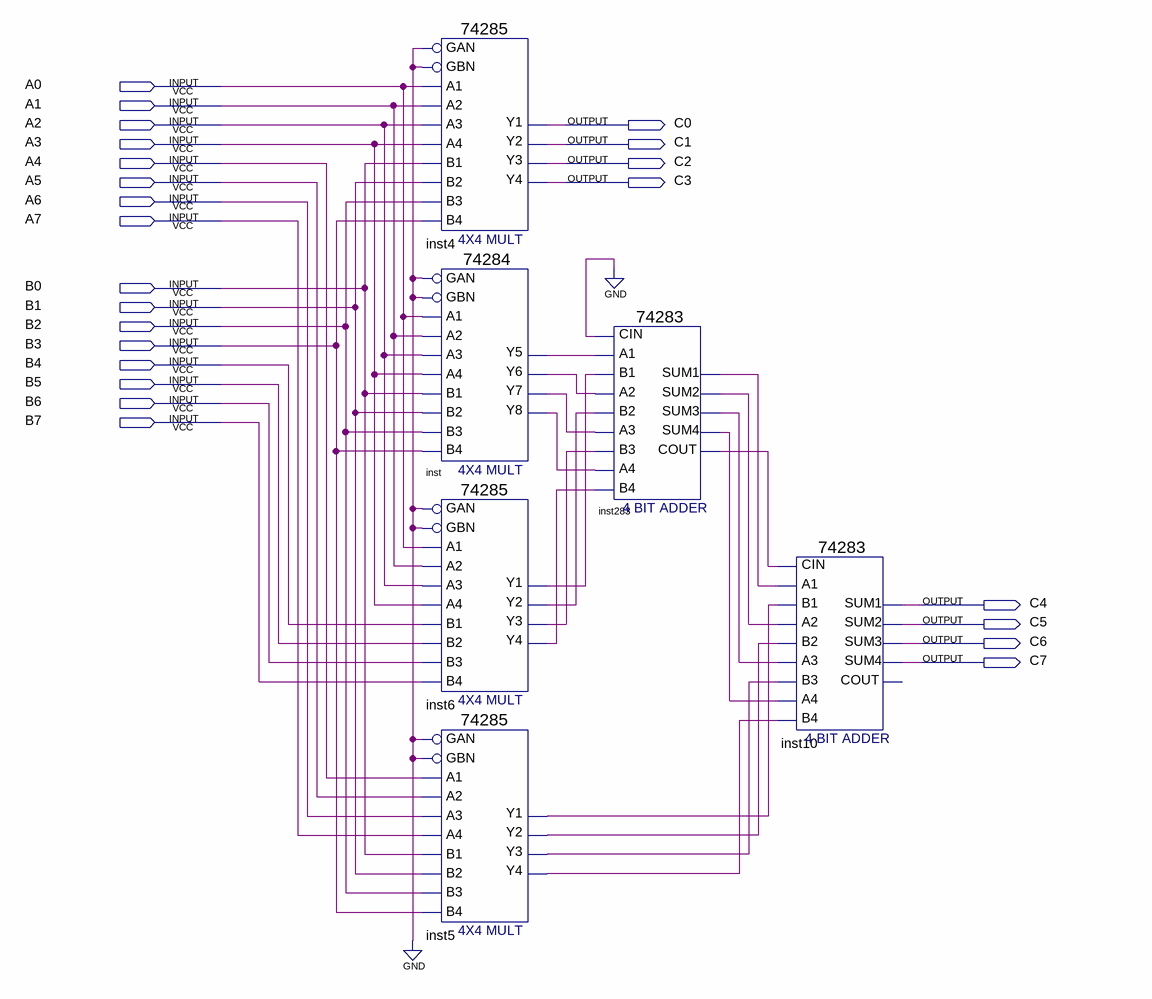
[diagram p0: schematic sheet]
// Quartus schematic 8bit_mul.bdf as structural Verilog: 6 symbols, 24 pins
module \8bit_mul  (
  input  A0,
  input  A1,
  input  A2,
  input  A3,
  input  A4,
  input  A5,
  input  A6,
  input  A7,
  input  B0,
  input  B1,
  input  B2,
  input  B3,
  input  B4,
  input  B5,
  input  B6,
  input  B7,
  output C0,
  output C1,
  output C2,
  output C3,
  output C4,
  output C5,
  output C6,
  output C7
);

  wire inst5_y1, inst5_y2, inst5_y3, inst5_y4, inst6_y1, inst6_y2, inst6_y3, inst6_y4, inst283_cout,
       inst283_sum1, inst283_sum2, inst283_sum3, inst283_sum4, inst_y5, inst_y6, inst_y7, inst_y8;

  \74285  inst4 (
    .GBN(1'b0), .GAN(1'b0), .A1(A0), .A2(A1), .A3(A2), .B2(B1), .B1(B0), .A4(A3), .B4(B3), .B3(B2), .Y4(C3),
    .Y1(C0), .Y2(C1), .Y3(C2));
  \74284  inst (
    .GAN(1'b0), .A2(A1), .A1(A0), .GBN(1'b0), .B1(B0), .A4(A3), .A3(A2), .B4(B3), .B3(B2), .B2(B1),
    .Y8(inst_y8), .Y6(inst_y6), .Y7(inst_y7), .Y5(inst_y5));
  \74285  inst6 (
    .GBN(1'b0), .GAN(1'b0), .A1(A0), .A2(A1), .A3(A2), .B2(B5), .B1(B4), .A4(A3), .B4(B7), .B3(B6),
    .Y4(inst6_y4), .Y1(inst6_y1), .Y2(inst6_y2), .Y3(inst6_y3));
  \74285  inst5 (
    .GBN(1'b0), .GAN(1'b0), .A1(A4), .A2(A5), .A3(A6), .B2(B1), .B1(B0), .A4(A7), .B4(B3), .B3(B2),
    .Y4(inst5_y4), .Y1(inst5_y1), .Y2(inst5_y2), .Y3(inst5_y3));
  \74283  inst283 (
    .CIN(1'b0), .A1(inst_y5), .A2(inst_y6), .B2(inst6_y2), .A3(inst_y7), .A4(inst_y8), .B4(inst6_y4),
    .B1(inst6_y1), .B3(inst6_y3), .SUM4(inst283_sum4), .COUT(inst283_cout), .SUM1(inst283_sum1),
    .SUM2(inst283_sum2), .SUM3(inst283_sum3));
  \74283  inst10 (
    .CIN(inst283_cout), .A1(inst283_sum1), .A2(inst283_sum2), .B2(inst5_y2), .A3(inst283_sum3),
    .A4(inst283_sum4), .B4(inst5_y4), .B1(inst5_y1), .B3(inst5_y3), .SUM4(C7), .SUM1(C4), .SUM2(C5), .SUM3(C6));  // open: COUT
endmodule
